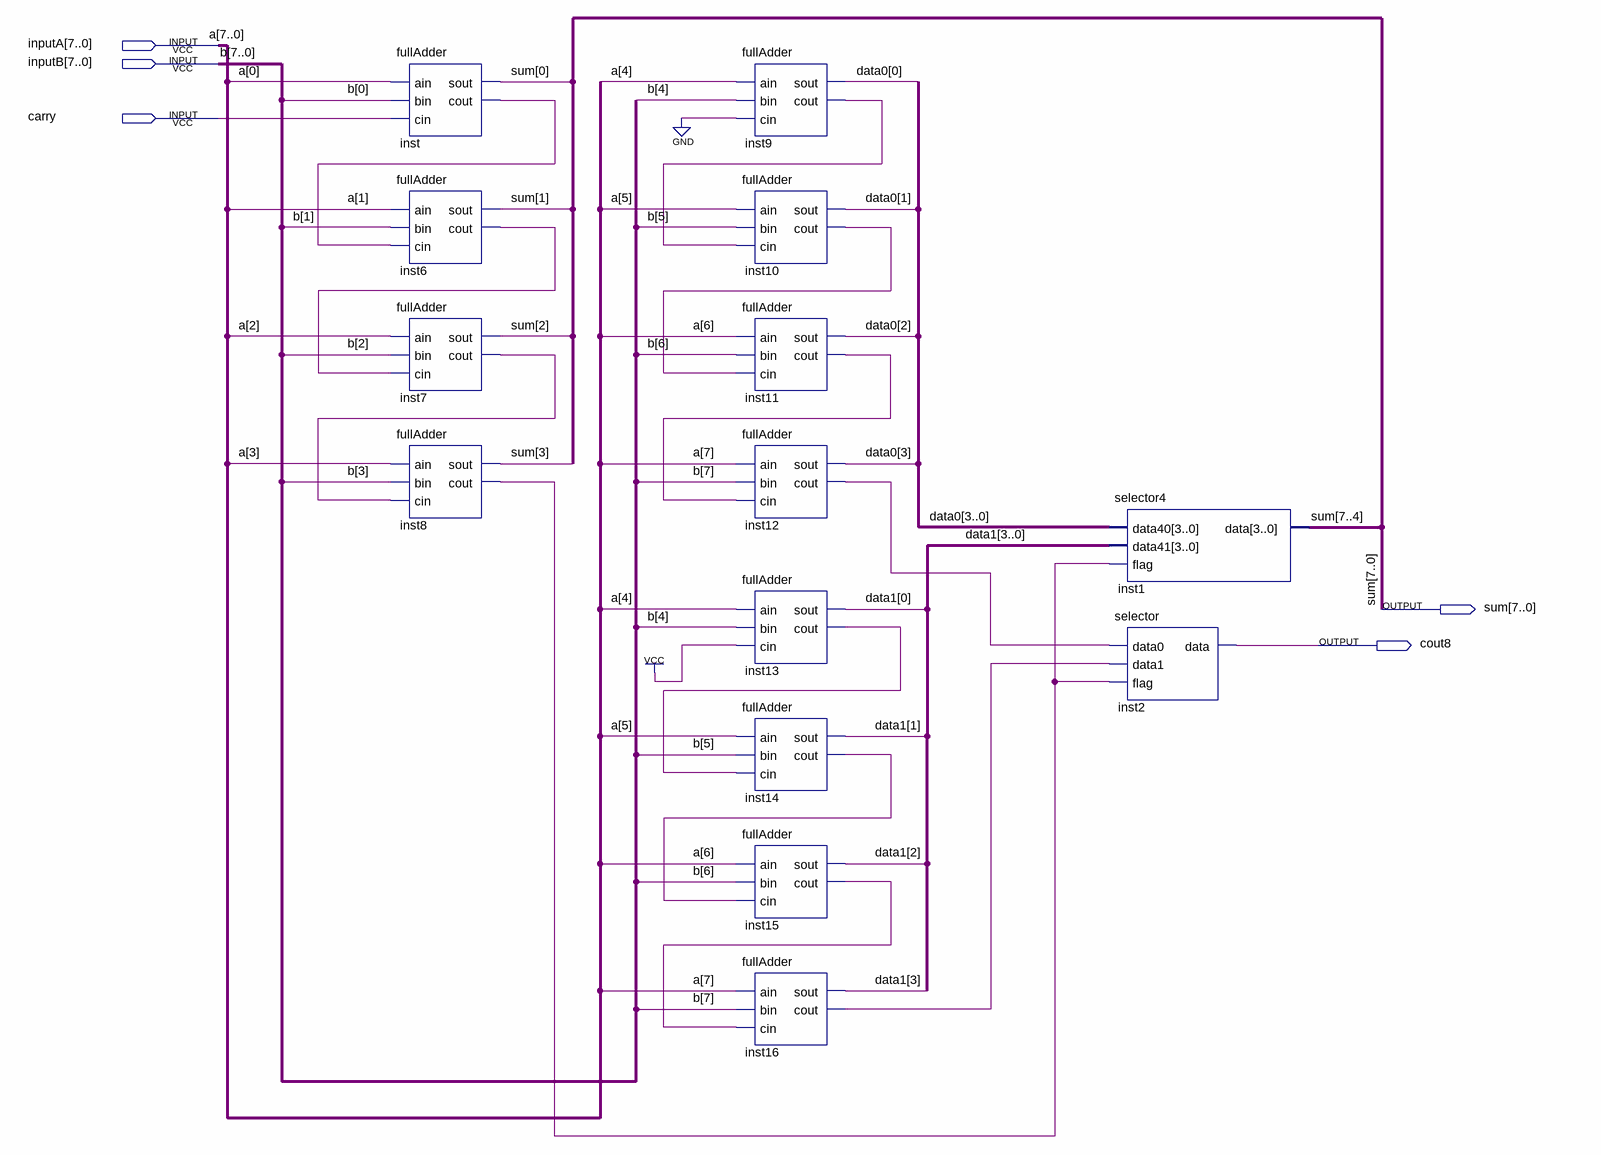
[diagram p0: schematic sheet]
// Quartus schematic adder8.bdf as structural Verilog: 14 symbols, 5 pins
module adder8 (
  input  [7:0] inputA,
  input  [7:0] inputB,
  input  carry,
  output [7:0] sum,
  output cout8
);

  wire inst6_cout, inst7_cout, inst8_cout, inst9_cout, inst10_cout, inst11_cout, inst12_cout, inst13_cout,
       inst14_cout, inst15_cout, inst16_cout, inst_cout;
  wire [3:0] data0, data1;

  fullAdder inst (.ain(inputA[0]), .bin(inputB[0]), .cin(carry), .sout(sum[0]), .cout(inst_cout));
  fullAdder inst6 (.ain(inputA[1]), .bin(inputB[1]), .cin(inst_cout), .sout(sum[1]), .cout(inst6_cout));
  fullAdder inst7 (.ain(inputA[2]), .bin(inputB[2]), .cin(inst6_cout), .sout(sum[2]), .cout(inst7_cout));
  fullAdder inst8 (.ain(inputA[3]), .bin(inputB[3]), .cin(inst7_cout), .sout(sum[3]), .cout(inst8_cout));
  fullAdder inst9 (.ain(inputA[4]), .bin(inputB[4]), .cin(1'b0), .sout(data0[0]), .cout(inst9_cout));
  fullAdder inst10 (.ain(inputA[5]), .bin(inputB[5]), .cin(inst9_cout), .sout(data0[1]), .cout(inst10_cout));
  fullAdder inst11 (.ain(inputA[6]), .bin(inputB[6]), .cin(inst10_cout), .sout(data0[2]), .cout(inst11_cout));
  fullAdder inst12 (.ain(inputA[7]), .bin(inputB[7]), .cin(inst11_cout), .sout(data0[3]), .cout(inst12_cout));
  fullAdder inst13 (.ain(inputA[4]), .bin(inputB[4]), .cin(1'b1), .sout(data1[0]), .cout(inst13_cout));
  fullAdder inst14 (.ain(inputA[5]), .bin(inputB[5]), .cin(inst13_cout), .sout(data1[1]), .cout(inst14_cout));
  fullAdder inst15 (.ain(inputA[6]), .bin(inputB[6]), .cin(inst14_cout), .sout(data1[2]), .cout(inst15_cout));
  fullAdder inst16 (.ain(inputA[7]), .bin(inputB[7]), .cin(inst15_cout), .sout(data1[3]), .cout(inst16_cout));
  selector4 inst1 (.data40(data0), .data41(data1), .flag(inst8_cout), .data(sum[7:4]));
  selector inst2 (.data0(inst12_cout), .data1(inst16_cout), .flag(inst8_cout), .data(cout8));

  // Other names for the same wires on the sheet: a[7:0] = inputA; b[7:0] = inputB
endmodule
